# EAGLE design Adafruit QT Py (EAGLE 9.6.2)
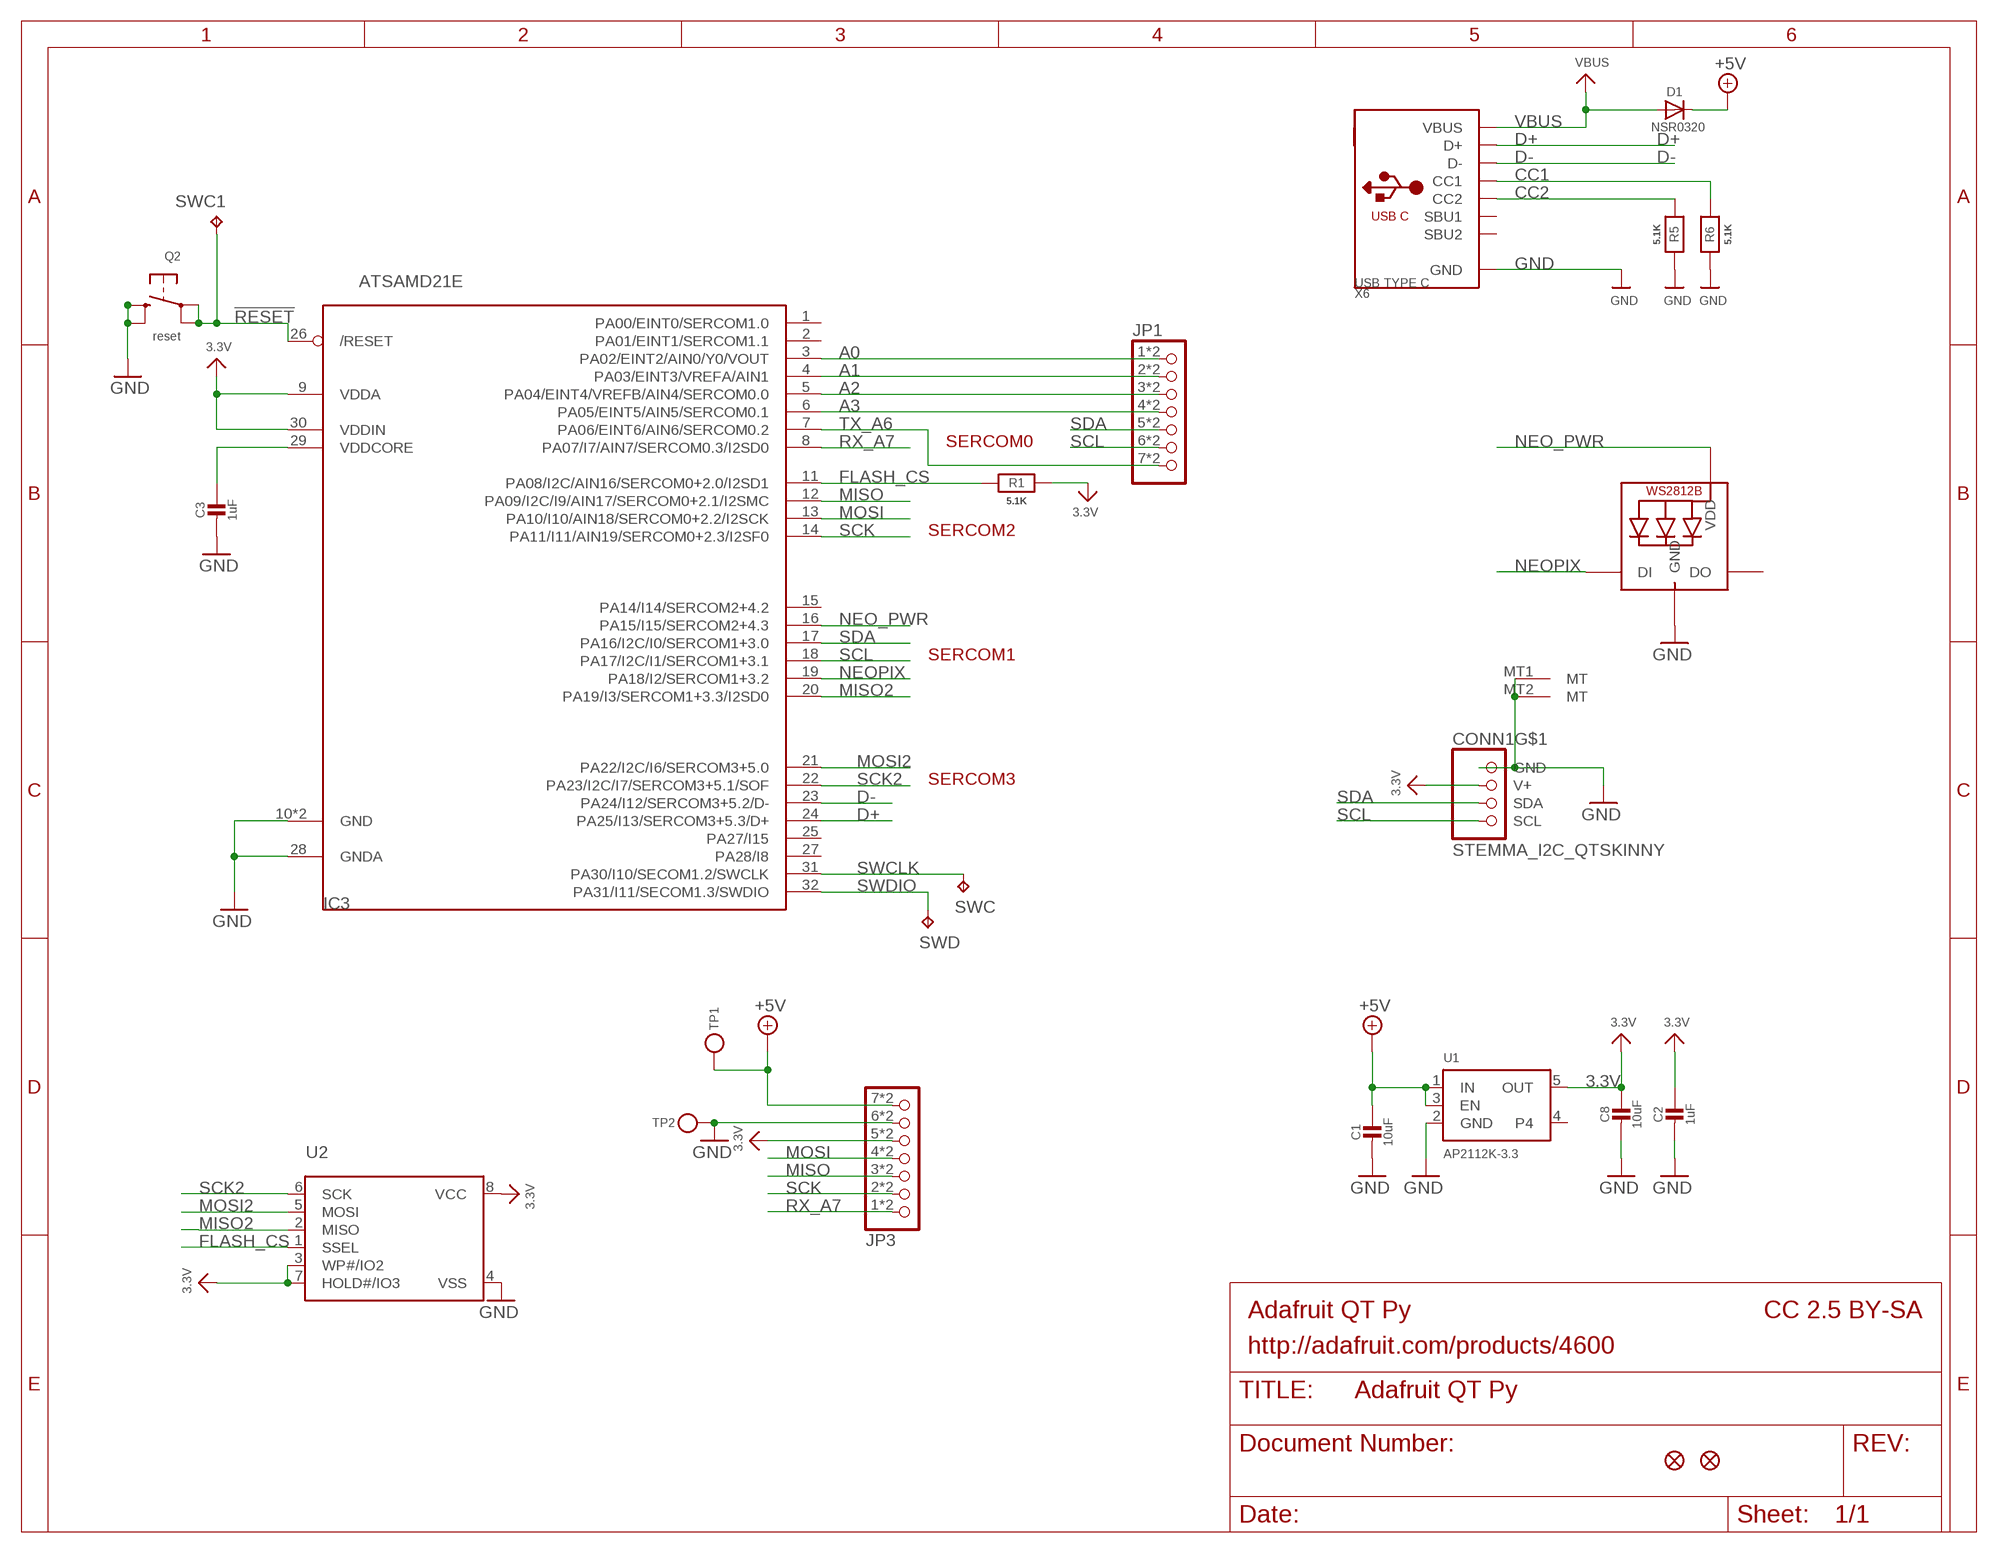
[diagram p0: schematic, sheet 1]

## Parts
C1  10uF  CAP_CERAMIC_0805MP  [_0805MP]
C2  1uF  CAP_CERAMIC_0402NO  [_0402NO]
C3  1uF  CAP_CERAMIC_0402NO  [_0402NO]
C8  10uF  CAP_CERAMIC_0805MP  [_0805MP]
CONN1  STEMMA_I2C_QTSKINNY  [JST_SH4_SKINNY]
D1  NSR0320  DIODE_SOD323MINI  [SOD-323_MINI]
IC3  ATSAMD21E  [QFN32_5MM]
JP1  HEADER-1X7_CASTEL  [1X07_CASTEL]
JP3  HEADER-1X7_CASTEL  [1X07_CASTEL]
LED1  WS2812B_SK6805_1515  [SK6805_1515]
Q2  reset  SWITCH_TACT_SMT4.6X2.8  [BTN_KMR2_4.6X2.8]
R1  5.1K  RESISTOR_0402NO  [_0402NO]
R5  5.1K  RESISTOR_0402NO  [_0402NO]
R6  5.1K  RESISTOR_0402NO  [_0402NO]
SWC  TPB1,27  [B1,27]
SWC1  TPB1,27  [B1,27]
SWD  TPB1,27  [B1,27]
TP1  TESTPOINT_1X3  [TESTPOINT_RECT_1X3MM]
TP2  TESTPOINT_1X3  [TESTPOINT_RECT_1X3MM]
U1  AP2112K-3.3  VREG_SOT23-5  [SOT23-5]
U2  SPIFLASH_8PIN  [SOIC8_150MIL]
U$6  FIDUCIAL_1MM  [FIDUCIAL_1MM]
U$8  FIDUCIAL_1MM  [FIDUCIAL_1MM]
X6  USB TYPE C  USB_C  [USB_C_CUSB31-CFM2AX-01-X]

## Nets
3.3V [power]: C2.1 C8.1 CONN1.2(V+) IC3.9(VDDA) IC3.30(VDDIN) JP3.5 JP3.5C R1.1 U1.5(OUT) U2.3(WP#/IO2) U2.7(HOLD#/IO3) U2.8(VCC)
!RESET: IC3.26(/RESET) Q2.A'(P1) Q2.A(P) SWC1.TP
+5V [power]: C1.1 D1.C JP3.7 JP3.7C TP1.P$1 U1.1(IN) U1.3(EN)
A0: IC3.3(PA02/EINT2/AIN0/Y0/VOUT) JP1.1 JP1.1C
A1: IC3.4(PA03/EINT3/VREFA/AIN1) JP1.2 JP1.2C
A2: IC3.5(PA04/EINT4/VREFB/AIN4/SERCOM0.0) JP1.3 JP1.3C
A3: IC3.6(PA05/EINT5/AIN5/SERCOM0.1) JP1.4 JP1.4C
CC1: R6.2 X6.A5(CC1)
CC2: R5.2 X6.B5(CC2)
D+: IC3.24(PA25/I13/SERCOM3+5.3/D+) X6.A6(D+) X6.B6(D+)
D-: IC3.23(PA24/I12/SERCOM3+5.2/D-) X6.A7(D-) X6.B7(D-)
FLASH_CS: IC3.11(PA08/I2C/AIN16/SERCOM0+2.0/I2SD1) R1.2 U2.1(SSEL)
GND [power]: C1.2 C2.2 C3.2 C8.2 CONN1.1(GND) CONN1.MT1(MT) CONN1.MT2(MT) IC3.10(GND) IC3.28(GNDA) IC3.33(GND) JP3.6 JP3.6C LED1.4(GND) Q2.B'(S1) Q2.B(S) R5.1 R6.1 TP2.P$1 U1.2(GND) U2.4(VSS) X6.A1B12(GND) X6.B1A12(GND)
MISO: IC3.12(PA09/I2C/I9/AIN17/SERCOM0+2.1/I2SMC) JP3.3 JP3.3C
MISO2: IC3.20(PA19/I3/SERCOM1+3.3/I2SD0) U2.2(MISO)
MOSI: IC3.13(PA10/I10/AIN18/SERCOM0+2.2/I2SCK) JP3.4 JP3.4C
MOSI2: IC3.21(PA22/I2C/I6/SERCOM3+5.0) U2.5(MOSI)
NEO_PWR: IC3.16(PA15/I15/SERCOM2+4.3) LED1.2(VDD)
NEOPIX: IC3.19(PA18/I2/SERCOM1+3.2) LED1.1(DI)
RX_A7: IC3.8(PA07/I7/AIN7/SERCOM0.3/I2SD0) JP3.1 JP3.1C
SCK: IC3.14(PA11/I11/AIN19/SERCOM0+2.3/I2SF0) JP3.2 JP3.2C
SCK2: IC3.22(PA23/I2C/I7/SERCOM3+5.1/SOF) U2.6(SCK)
SCL: CONN1.4(SCL) IC3.18(PA17/I2C/I1/SERCOM1+3.1) JP1.6 JP1.6C
SDA: CONN1.3(SDA) IC3.17(PA16/I2C/I0/SERCOM1+3.0) JP1.5 JP1.5C
SWCLK: IC3.31(PA30/I10/SECOM1.2/SWCLK) SWC.TP
SWDIO: IC3.32(PA31/I11/SECOM1.3/SWDIO) SWD.TP
TX_A6: IC3.7(PA06/EINT6/AIN6/SERCOM0.2) JP1.7 JP1.7C
VBUS [power]: D1.A X6.A4B9(VBUS) X6.B4A9(VBUS)
VDDCORE: C3.1 IC3.29(VDDCORE)
Unconnected: IC3.1(PA00/EINT0/SERCOM1.0) IC3.2(PA01/EINT1/SERCOM1.1) IC3.15(PA14/I14/SERCOM2+4.2) IC3.25(PA27/I15) IC3.27(PA28/I8) LED1.3(DO) U1.4 X6.A8(SBU1) X6.B8(SBU2)

## Notes on the sheet
- SERCOM0
- SERCOM2
- SERCOM1
- SERCOM3
- Adafruit QT Py | CC 2.5 BY-SA
- http://adafruit.com/products/4600

## Library data of the parts
C1-C3 C8 = microbuilder:CAP_CERAMIC: Ceramic Capacitors For new designs, use the packages preceded by an '_' character since they are more reliable: The following footprints should be used on most boards: _0402 - Standard footprint for regular board layouts _0603 - Standard footprint for regular board layouts _0805 - Standard footprint for regular board layouts _1206 - Standard footprint for regular board layouts For extremely tight-pitch boards where space is at a premium, the following 'micro-pitch' footprints can be used (smaller pads, no silkscreen outline, etc.): _0402MP - Micro-pitch footprint for very dense/compact boards _0603MP - Micro-pitch footprint for very dense/compact boards _0805MP - Micro-pitch footprint for very dense/compact boards _1206MP - Micro-pitch footprint for very dense/compact boards
CONN1 = microbuilder:STEMMA_I2C
D1 = microbuilder:DIODE: Diode SMA Model Volts Amps Type Vf Ir Digikey # Notes SSA34-E3 40V 3A Schottky 480mV @ 3A 200uA @ 40V SSA34-E3/61TGITR-ND CDBA120-G 20V 1A Schottky 500mV @ 1A 500uA @ 20V 641-1014-6-ND REEL MBRA210 10V 2A Schottky 350mV @ 2A 700uA @ 10V MBRA210LT3 SOD-123 Model Volts Amps Type Vf Ir Order # Notes BAT54T1G 30V 200mA Schottky 800mV @ 200mA 2uA @ 25V BAT54T1GOSTR-ND B0530W 30V 500mA Schottky 430mV @ 500mA 130uA @ 30V B0530W-FDICT-ND REEL MBR120 20V 1A Schottky 340mV @ 1A MBR120VLSFT1GOSCT-ND SOD-323 Model Volts Amps Type Vf Ir Order # Notes PMEG2005EJ 20V 500mA Schottky 355mV @ 500mA 568-4110-1-ND ZLLS410 10V 570mA Schottky 380mV @ 570mA ZLLS410CT-ND 1N4148WS 75V 150mA Silicon/Simple 1V 1N4148WSFSCT-ND REEL SOD-523 Model Volts Amps Type Vf Ir Order # Notes BAT54XV2 30V 200mA Schottky 0.8V @ 100mA BAT54XV2CT-ND TB751S 30V 30mA Schottky RB751S-40TE61CT-ND SOT23-R/W (R = Solder Paste/Reflow Ovens, W = Hand-Soldering) Model Volts Amps Type Vf Ir Order # Notes BAT54FILM 40V 300mA Schottky 497-7162-1-ND POWERDI-5 Model Volts Amps Type Vf Ir Order # Notes PDS560 60V 5A Schottky 670mV @ 5A 150uA @ 60V PDS560DICT-ND
IC3 = adafruit_micro:ATSAMD21E
JP1 JP3 = microbuilder:HEADER-1X7: PIN HEADER
LED1 = microbuilder:WS2812B
Q2 = microbuilder:SWITCH_TACT_SMT: SMT Tact Switches 6x6mm - Digikey: P12940SCT-ND KMR2 (4.6x2.8mm) - Digikey: 401-1426-1-ND EVQ-PQHB55 - Light Touch, 160GF (4.5x4.5mm) - Digikey: P8090SCT-ND KMT0 - KMT021 NGJ LHS (etc.) IP68/Waterproof - Digikey: CKN10289CT-ND
R1 R5 R6 = microbuilder:RESISTOR: Resistors For new designs, use the packages preceded by an '_' character since they are more reliable: The following footprints should be used on most boards: _0402 - Standard footprint for regular board layouts _0603 - Standard footprint for regular board layouts _0805 - Standard footprint for regular board layouts _1206 - Standard footprint for regular board layouts For extremely tight-pitch boards where space is at a premium, the following 'micro-pitch' footprints can be used (smaller pads, no silkscreen outline, etc.): _0402MP - Micro-pitch footprint for very dense/compact boards _0603MP - Micro-pitch footprint for very dense/compact boards _0805MP - Micro-pitch footprint for very dense/compact boards _1206MP - Micro-pitch footprint for very dense/compact boards
SWC SWC1 SWD = testpad:TP: Test pad
TP1 TP2 = microbuilder:TESTPOINT: Test Point Various test points for characterisation and PCB testing TESTPOINT_SMT - Compact Surface Mount Test Point [Digikey: 5016KTR-ND]
U1 = adafruit_power:VREG_SOT23-5: SOT23-5 Fixed Voltage Regulators Part Current Out V Out V In V Dropout θJA (°C/W) TJ (°C) Digikey Part No. ADP121 150mA 3.3V 3.4-5.5V 0.09V @ 150mA -- -- ADP121-AUJZ33R7CT-ND ADP121 150mA 3.0V 3.1-5.5V 0.09V @ 150mA -- -- ADP121-AUJZ30R7CT-ND ADP122 300mA 3.3V 3.4-5.5V 0.085V @ 300mA -- -- ADP122AUJZ-3.3-R7CT-ND ADP1712 300mA 3.3V 3.5-5.5V 0.17V @ 300mA -- -- ADP1712AUJZ-3.3-R7TR-ND AP7311 (Low Cost) 150mA 3.3V 3.5-6V 0.15V @ 150mA -- -- AP7311-33WG-7DICT-ND LD39015M18R 150mA 1.8V 1.9V-5.5V 0.08V @ 100mA -- -- 497-6977-1-ND LP2985A-33DBVR 150mA 3.3V 3.3-16V 0.28V @ 150mA 206 150 296-18479-1-ND MCP1824T-3302E/OT 300mA 3.3V 3.5V-6V 0.2V @ 300mA -- -- MCP1824T-3302E/OTCT-ND MIC5205-2.5YM5 TR 150mA 2.5V 2.7-16V 0.165V @ 150mA -- -- 576-1257-2-ND MIC5205-3.0YM5 TR 150mA 3.0V 3.2V-16V 0.165V @ 150mA -- -- 576-1258-2-ND MIC5205-3.3YM5 TR 150mA 3.3V 3.5V-16V 0.165V @ 150mA -- -- 576-1259-2-ND TPS780330220 150mA 3.3V+2.2V 3.6-5.5V 250mV Max -- -- 296-23332-1-ND TDA3663/N1,135 100mA 3.3V 3.5-45V 0.18V @ 50mA -- -- 568-5343-1-ND Max operating temp can be calculated using θJA, TJ (max junction temperature), and power in watts. Set the "Maximum Ambient Temperature" until it reaches TJ ("Max Junction Temperature"), which is the absolute limit for safe use of the regulator: Heat Sink Temperature Calculator <http://www.daycounter.com/Calculators/Heat-Sink-Temperature-Calculator.phtml> For example, With 12V source into a 3.3V LP2985 and a 30mA load, we are dissipating (12V-3.3V) * 0.03A = 0.261W. With a θJA of 206 °C/W, a TJ of 150°C, and 261mW we can safely use the chip without a heat sink up to 75°C (=147.1°C Junction Temperature).
U2 = microbuilder:SPIFLASH_8PIN: SOIC8 SPI Flash Be careful with the size since SOIC8 flash comes in several 'widths' SOIC8 150 mil M25P16 - 16Mbit (2Mbit x 8) Serial Flash (75MHz SPI Bus), Supply: 2.7-3.6V Digikey: SOIC8 - M25P16-VMN6P-ND SOIC8 208 mil W25Q16BVSSIG - 16Mbit (2Mbit x 8) Serial Flash (104MHz SPI Bus), Supply: 2.7-3.6V Digikey: SOIC8 - W25Q16BVSSIG-ND
U$6 U$8 = microbuilder:FIDUCIAL: Fiducial Alignment Points Various fiducial points for machine vision alignment.; BOM: EXCLUDE
X6 = microbuilder:USB_C: USB Type-C USB 2.0 Connector

## Net classes
1 power: width 0.254 mm
2 gnd: width 0.254 mm

## Board
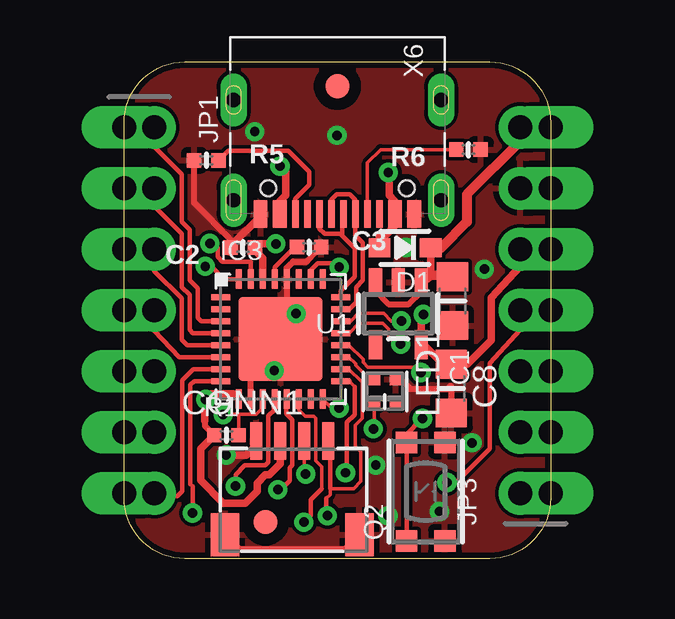
[diagram p1: board, top side]
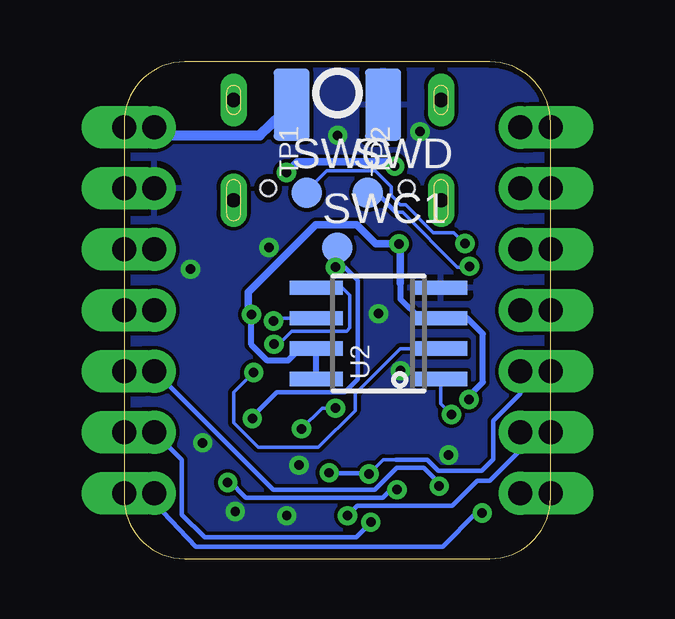
[diagram p2: board, bottom side, seen from below]

Size 17.78 x 20.7 mm. Coordinates in mm from the lower left corner, seen from the top.
Outline: 17.78,18.16 17.78,2.54 arc-90 15.24,0 2.54,0 arc-90 0,2.54 0,18.16 arc-90 2.54,20.7 15.24,20.7 arc-90 17.78,18.16
Copper layers (1*16): Top 0.035mm / dielectric 1.5mm / Bottom 0.035mm
Design rules "adafruit 6-6": minimum track width 6mil, minimum drill 15.5mil, track to track 6mil, track to pad 6mil, pad to pad 6mil, via to via 6mil, smd to smd 6mil, copper to edge 10mil, drill to drill 8mil, minimum pad ring 10mil, minimum via ring 8mil, stop-mask expansion 2mil, vias tented up to drill 20mil, thermal gap 10mil

### Footprints (pad centres in the part's own frame; a part is rotated, then mirrored left to right if it is on the bottom)
_0805MP = smd 1.2 x 1.3: 1 -1.016,0; 2 1.016,0
_0402NO = smd 0.6 x 0.6: 1 -0.508,0; 2 0.508,0
JST_SH4_SKINNY = smd 0.5 x 1.55: 1 -1.5,2.514; 2 -0.5,2.514; 3 0.5,2.514; 4 1.5,2.514 | smd 1.2 x 1.8: MT1 -2.8,-1.386; MT2 2.8,-1.386
SOD-323_MINI = smd 0.9 x 0.8: A 1.07,0; C -1.07,0
QFN32_5MM = smd 0.8 x 0.25: 1 -2.5,1.75; 2 -2.5,1.25; 3 -2.5,0.75; 4 -2.5,0.25; 5 -2.5,-0.25; 6 -2.5,-0.75; 7 -2.5,-1.25; 8 -2.5,-1.75; 17 2.5,-1.75; 18 2.5,-1.25; 19 2.5,-0.75; 20 2.5,-0.25; 21 2.5,0.25; 22 2.5,0.75; 23 2.5,1.25; 24 2.5,1.75 | smd 0.25 x 0.8: 9 -1.75,-2.5; 10 -1.25,-2.5; 11 -0.75,-2.5; 12 -0.25,-2.5; 13 0.25,-2.5; 14 0.75,-2.5; 15 1.25,-2.5; 16 1.75,-2.5; 25 1.75,2.5; 26 1.25,2.5; 27 0.75,2.5; 28 0.25,2.5; 29 -0.25,2.5; 30 -0.75,2.5; 31 -1.25,2.5; 32 -1.75,2.5 | smd 3.5 x 3.5: 33 0,0
1X07_CASTEL = drill 1 pad 1.778: 1 -7.62,0; 2 -5.08,0; 3 -2.54,0; 4 0,0; 5 2.54,0; 6 5.08,0; 7 7.62,0 | drill 1 pad 1.778 long: 1C -7.62,-1.27; 2C -5.08,-1.27; 3C -2.54,-1.27; 4C 0,-1.27; 5C 2.54,-1.27; 6C 5.08,-1.27; 7C 7.62,-1.27
SK6805_1515 = smd 0.5 x 0.5: 1 -0.5,-0.45; 2 0.5,-0.45; 3 0.5,0.45; 4 -0.5,0.45
BTN_KMR2_4.6X2.8 = smd 0.9 x 0.9: A 2.05,0.8; A' -2.05,0.8; B 2.05,-0.8; B' -2.05,-0.8
B1,27 = smd 1.27 x 1.27: TP 0,0
TESTPOINT_RECT_1X3MM = smd 3 x 1.5: P$1 0,0
SOT23-5 = smd 0.55 x 1.2: 1 -0.95,-1.3; 2 0,-1.3; 3 0.95,-1.3; 4 0.95,1.3; 5 -0.95,1.3
SOIC8_150MIL = smd 0.6 x 2.2: 1 -1.905,-2.6; 2 -0.635,-2.6; 3 0.635,-2.6; 4 1.905,-2.6; 5 1.905,2.6; 6 0.635,2.6; 7 -0.635,2.6; 8 -1.905,2.6
FIDUCIAL_1MM = smd 1 x 1: 1 0,0
USB_C_CUSB31-CFM2AX-01-X = smd 0.575 x 1.15: A1B12 -3.2,3.545; A4B9 -2.4,3.545; B1A12 3.2,3.545; B4A9 2.4,3.545 | smd 0.275 x 1.15: A5 -1.25,3.545; A6 -0.25,3.545; A7 0.25,3.545; A8 1.25,3.545; B5 1.75,3.545; B6 0.75,3.545; B7 -0.75,3.545; B8 -1.75,3.545 | drill 0.6 pad 1 long: M1 -4.32,2.97; M2 4.32,2.97; M3 -4.32,-1.21; M4 4.32,-1.21 | hole 0.65: 2.89,2.47; -2.89,2.47

### Placement (x,y rotation side)
C1  13.69,10.73 270 top
C2  4.95,12.97 180 top
C3  7.71,12.98 0 top
C8  13.64,7.09 270 top
CONN1  7.01,2.39 0 top
D1  11.71,12.95 180 top
IC3  6.53,9.15 0 top
JP1  1.27,10.35 270 top
JP3  16.51,10.35 90 top
LED1  10.87,6.97 270 top
Q2  12.57,2.79 90 top
R1  4.27,5.14 0 top
R5  3.43,16.6 0 top
R6  14.35,17.04 180 top
SWC  10.16,15.24 0 bottom
SWC1  8.89,12.95 0 bottom
SWD  7.62,15.24 0 bottom
TP1  10.79,18.92 270 bottom
TP2  6.99,18.92 270 bottom
U1  11.43,10.21 180 top
U2  7.18,9.39 90 bottom
U$6  5.89,1.52 0 top
U$8  8.89,19.68 0 top
U$11  [QTPY_BOT]  17.78,0 0 bottom
U$12  [PCBFEAT-REV-040]  8.89,19.41 0 bottom
U$13  [QTPY_TOP]  0,0 0 top
X6  8.89,17.91 180 top

### Tracks (layer width: path | path; a pad name or v marks a point on that pad's centre or on a via)
3.3V  (via drill 0.39)
  Top 0.254: 3.37,5.75 3.37,5.54 R1.1
  Top 0.305: IC3.30 5.78,12.51 5.46,12.83 C2.1 5.61,13.12 v6.33,13.12 | IC3.9 4.56,6.87 3.64,6.87 v3.4,6.63 3.37,6.59 3.37,5.75 | v12.47,10.17 12.38,10.08 U1.5 12.49,8.91 13.3,8.1 C8.1 14.3,8.1 15.3,9.11 15.3,10.88 16.51,12.19 JP3.5 16.37,12.74 16.52,12.89 JP3.5C | R1.1 3.19,4.57 3.19,3.26 4.13,2.32 5.06,2.32 5.55,2.81 5.55,3.15 5.89,3.49 6.06,3.49 6.51,3.95 CONN1.2
  Bottom 0.254: v3.4,6.63 3.33,6.71 3.33,6.86 2.83,7.35 2.83,9.37 3.48,10.02 U2.3 5.46,10.02 6.26,10.82 6.26,11.47 | U2.8 U2.7 10.45,8.75 10.95,8.26 11.81,8.26 12.47,8.91 v12.47,10.17
  Bottom 0.305: 6.26,11.47 6.26,13.06 v6.33,13.12 7.29,13.12 8.08,13.91 9.79,13.91 12.6,11.1 12.6,10.3 v12.47,10.17
!RESET  (via drill 0.39)
  Top 0.178: IC3.26 7.78,12.02 8.06,12.31 8.81,12.31 v8.97,12.15 | 11.6,5.02 11.71,4.91 | 11.71,4.91 Q2.A Q2.A' | v12.43,5.84 11.71,5.12 11.71,4.91
  Bottom 0.178: v8.97,12.15 8.58,12.15 8.04,11.61 8.04,7.47 8.57,6.93 11.42,6.93 12.43,5.92 v12.43,5.84
  Bottom 0.203: SWC1.TP 8.89,12.22 v8.97,12.15
+5V
  Top 0.254: U1.3 10.48,11.13 11.01,10.6 11.87,10.6 12.38,11.11 U1.1
  Top 0.305: U1.1 12.78,11.91 D1.C
  Top 0.406: C1.1 12.74,11.8 U1.1 | D1.C 13.21,12.95 14.29,14.03 14.29,15.18 16.51,17.4 JP3.7 JP3.7C
  Bottom 0.406: JP3.7 16.18,17.64 12.12,17.64 TP1.P$1
A0
  Top 0.178: IC3.3 3.22,9.9 3.07,10.05 3.07,11.27 2.74,11.6 2.74,13.7 2.41,14.03 2.41,16.03 1.27,17.17 JP1.1
  Top 0.406: JP1.1C JP1.1
A1
  Top 0.178: JP1.2 1.35,15.23 1.35,14.61 2.41,13.54 2.41,11.32 2.74,10.99 2.74,9.53 2.86,9.4 IC3.4
  Top 0.406: JP1.2C JP1.2
A2
  Top 0.178: 1.36,12.87 JP1.3 1.27,11.98 2.41,10.84 2.41,9.13 2.63,8.9 IC3.5
  Top 0.406: JP1.3C 1.34,12.89 1.36,12.87
A3
  Top 0.178: 1.33,10.29 JP1.4 1.27,9.5 2.3,8.4 IC3.6
  Top 0.406: JP1.4C JP1.4 1.33,10.29
CC1
  Top 0.152: X6.A5 10.14,16.49 10.69,17.04 R6.2
CC2
  Top 0.178: R5.2 4.34,17 6.84,17 7.72,16.13 7.72,15.58 7.14,15 X6.B5
D+
  Top 0.178: IC3.24 9.03,11.17 9.61,11.75 9.61,12.94 9.09,13.46 | 9.09,13.46 9.09,14.31 X6.A6 | X6.B6 8.14,13.75 8.36,13.53 9.02,13.53 9.09,13.46
D-
  Top 0.178: X6.A7 8.64,14.96 8.87,15.19 9.41,15.19 9.64,14.96 X6.B7 9.64,13.47 9.94,13.17 9.94,11.6 9.67,11.32 9.67,10.68 9.4,10.41 IC3.23
FLASH_CS  (via drill 0.39)
  Top 0.152: v4.13,6.01 4.78,6.01 | 4.78,6.01 5.5,6.01 5.78,6.28 IC3.11 | R1.2 4.78,6.01
  Bottom 0.152: U2.1 4.58,6.45 v4.13,6.01
GND  (via drill 0.39)
  Top 0.254: C3.2 8,12.76 7.99,12.76 7.61,12.38 7.05,12.38 6.78,12.11 IC3.28 6.78,9.4 IC3.33 | 5.43,4.96 CONN1.1 | IC3.10 5.28,7.9 IC3.33 | C2.2 4.45,13.3 2.92,14.82 R5.1 | IC3.33 6.53,9.56 v7.18,10.21 | CONN1.MT1 4.81,0.41 5.74,0.41 | 5.74,0.41 | 5.74,0.41 9.21,0.41 CONN1.MT2 | LED1.4 11.53,7.47 11.92,7.08 13.48,7.08 13.59,7.19 13.61,7.19 13.64,7.16 C8.2
  Top 0.305: X6.B1A12 5.69,14.28 4.45,13.03 C2.2 | CONN1.1 5.48,4.7 5.09,4.32 v4.25,4.32
  Top 0.406: JP3.6C JP3.6
  other vias: 14.5,4.83 15.01,12.06 5.45,17.79 11.73,12.97 8.88,17.64 13.14,1.97 11,1.79 6.26,7.84 10.49,3.9
  pour Top: 0,0 0,20.64 17.78,20.64 17.78,0
  pour Bottom: 0,0 0,20.64 17.78,20.64 17.78,0
MISO  (via drill 0.39)
  Top 0.178: IC3.12 6.28,6.21 6.02,5.95 6.02,4.01 5.89,3.89 5.03,3.89 4.65,3.5 v4.65,3.02
  Top 0.406: JP3.3C JP3.3
  Bottom 0.178: JP3.3 16.5,7.81 11.56,2.87 7.32,2.87 6.41,3.79 5.28,3.79 4.65,3.15 v4.65,3.02
MISO2  (via drill 0.39)
  Top 0.152: IC3.20 9.37,8.9 9.96,8.32 9.96,8.18 10.16,7.98 12.18,7.98 12.38,7.79 v12.38,7.76
  Bottom 0.152: U2.2 6.27,8.75 8.15,6.87 8.15,6.17 9.68,4.65 12.19,4.65 13.21,5.66 13.21,6.93 v12.38,7.76
MOSI  (via drill 0.39)
  Top 0.178: JP3.4 16.51,9.54 15.24,8.14 15.24,4.57 13.84,3.17 v13.46,3.17 | v6.41,2.88 6.53,2.88 6.92,3.26 6.92,3.79 7.02,3.9 7.02,5.78 6.76,6.04 6.76,6.63 IC3.13
  Top 0.406: JP3.4C JP3.4
  Bottom 0.178: v6.41,2.88 6.66,2.88 7,2.54 12.7,2.54 13.4,3.24 v13.46,3.17
MOSI2  (via drill 0.39)
  Top 0.152: IC3.21 9.38,9.4 9.78,9.8 10.78,9.8 11.02,9.57 11.02,9.24 11.33,8.94 v11.53,8.94
  Bottom 0.152: U2.5 8.69,11.29 8.37,10.97 8.37,9.61 8.51,9.47 10.8,9.47 11.34,8.94 v11.53,8.94
NEO_PWR  (via drill 0.39)
  Top 0.152: IC3.16 8.65,6.27 v8.97,6.27 | LED1.2 10.42,5.41 v10.39,5.41
  Bottom 0.152: v10.39,5.41 9.53,6.27 v8.97,6.27
NEOPIX
  Top 0.152: LED1.1 10.42,7.49 10.23,7.67 10.03,7.67 9.65,8.05 9.65,8.12 9.37,8.4 IC3.19
RX_A7  (via drill 0.39)
  Top 0.178: IC3.8 2.92,7.4 2.76,7.24 2.76,3.11 2.86,3.01 v2.86,1.91 2.86,1.57
  Top 0.406: JP3.1C JP3.1
  Bottom 0.178: v2.86,1.91 3.11,1.91 4.51,0.51 14.79,0.51 16.51,2.33 JP3.1
SCK  (via drill 0.39)
  Top 0.152: IC3.14 7.28,6.21 7.56,5.93 7.91,5.93 7.99,5.85 7.99,4.08 8.23,3.83 8.23,2.92
  Top 0.178: v7.49,1.52 7.77,1.8 7.77,2.46 8.23,2.92
  Top 0.406: JP3.2C JP3.2
  Bottom 0.178: v7.49,1.52 7.49,1.5 8.1,0.89 14.41,0.89 15.37,1.84 15.37,4.13 JP3.2
SCK2  (via drill 0.39)
  Top 0.152: v11.55,9.9 11.13,9.9 10.82,10.22 9.76,10.22 9.44,9.9 IC3.22
  Bottom 0.152: U2.6 11.44,10.02 v11.55,9.9
SCL  (via drill 0.39)
  Top 0.152: IC3.18 9.37,7.9 9.9,7.37 9.93,7.37 9.93,5.86 9.63,5.55 9.63,4.69 9.86,4.45 9.86,3.22 9.56,2.92 8.59,2.92 8.59,2.67 8.43,2.52
  Top 0.178: v8.47,1.79 8.43,1.83 8.43,2.52 | CONN1.4 8.59,4.83 8.59,2.92 | JP1.6C JP1.6
  Bottom 0.178: JP1.6 1.27,4.52 2.54,3.25 3.05,3.25 4.09,2.21 8.05,2.21 v8.47,1.79
SDA  (via drill 0.39)
  Top 0.152: 9.61,7.15 9.4,7.37 9.4,7.4 | CONN1.3 7.51,3.59 v7.57,3.53
  Top 0.178: IC3.17 9.4,7.4 | 9.61,7.15 9.61,6.01 9.28,5.68 9.28,3.63 v9.23,3.58
  Top 0.406: JP1.5C JP1.5
  Bottom 0.152: 6.46,4.13 6.97,4.13 v7.57,3.53
  Bottom 0.178: v9.23,3.58 9.26,3.56 7.67,3.56 7.62,3.5 7.59,3.5 v7.57,3.53 | 6.46,4.13 5.14,4.13 4.69,3.67 2.87,3.67 2.4,4.14 2.4,5.74 1.27,6.87 JP1.5
SWCLK  (via drill 0.39)
  Top 0.178: IC3.31 5.28,12.38 4.09,12.38 3.9,12.57 3.9,12.96 3.73,13.13 v3.58,13.13
  Bottom 0.152: v3.58,13.13 4.03,13.59 4.89,13.59 6.05,14.74 6.26,14.74 6.66,15.14 6.66,15.51 7.3,16.15 9.34,16.15 9.97,15.52 SWC.TP
SWDIO  (via drill 0.39)
  Top 0.178: IC3.32 4.15,11.65 3.63,12.18 v3.38,12.18
  Bottom 0.152: v3.38,12.18 3.41,12.15 3.89,12.15 6.17,14.44 6.45,14.44
  Bottom 0.178: SWD.TP 7.25,15.24 6.45,14.44
TX_A6
  Top 0.178: IC3.7 2.88,7.9 2.43,7.44 2.43,2.81 2.22,2.6 JP1.7
  Top 0.406: JP1.7C JP1.7
VBUS  (via drill 0.39)
  Top 0.305: D1.A 10.64,13.39 10.73,13.48 10.9,13.48 11.29,13.87 X6.A4B9 11.29,14.89 11.05,15.13 11.05,16.05 v11.01,16.09 | X6.B4A9 6.49,14.89 6.73,15.13 6.73,16.13 v6.5,16.36
  Bottom 0.305: v11.01,16.09 10.57,16.54 6.68,16.54 v6.5,16.36
VDDCORE
  Top 0.178: IC3.29 6.28,12.14 7.11,12.98 C3.1